# EAGLE design openvfo_nextion_teensy_4.0 (EAGLE 9.5.2)
Assembly variants: <unnamed>
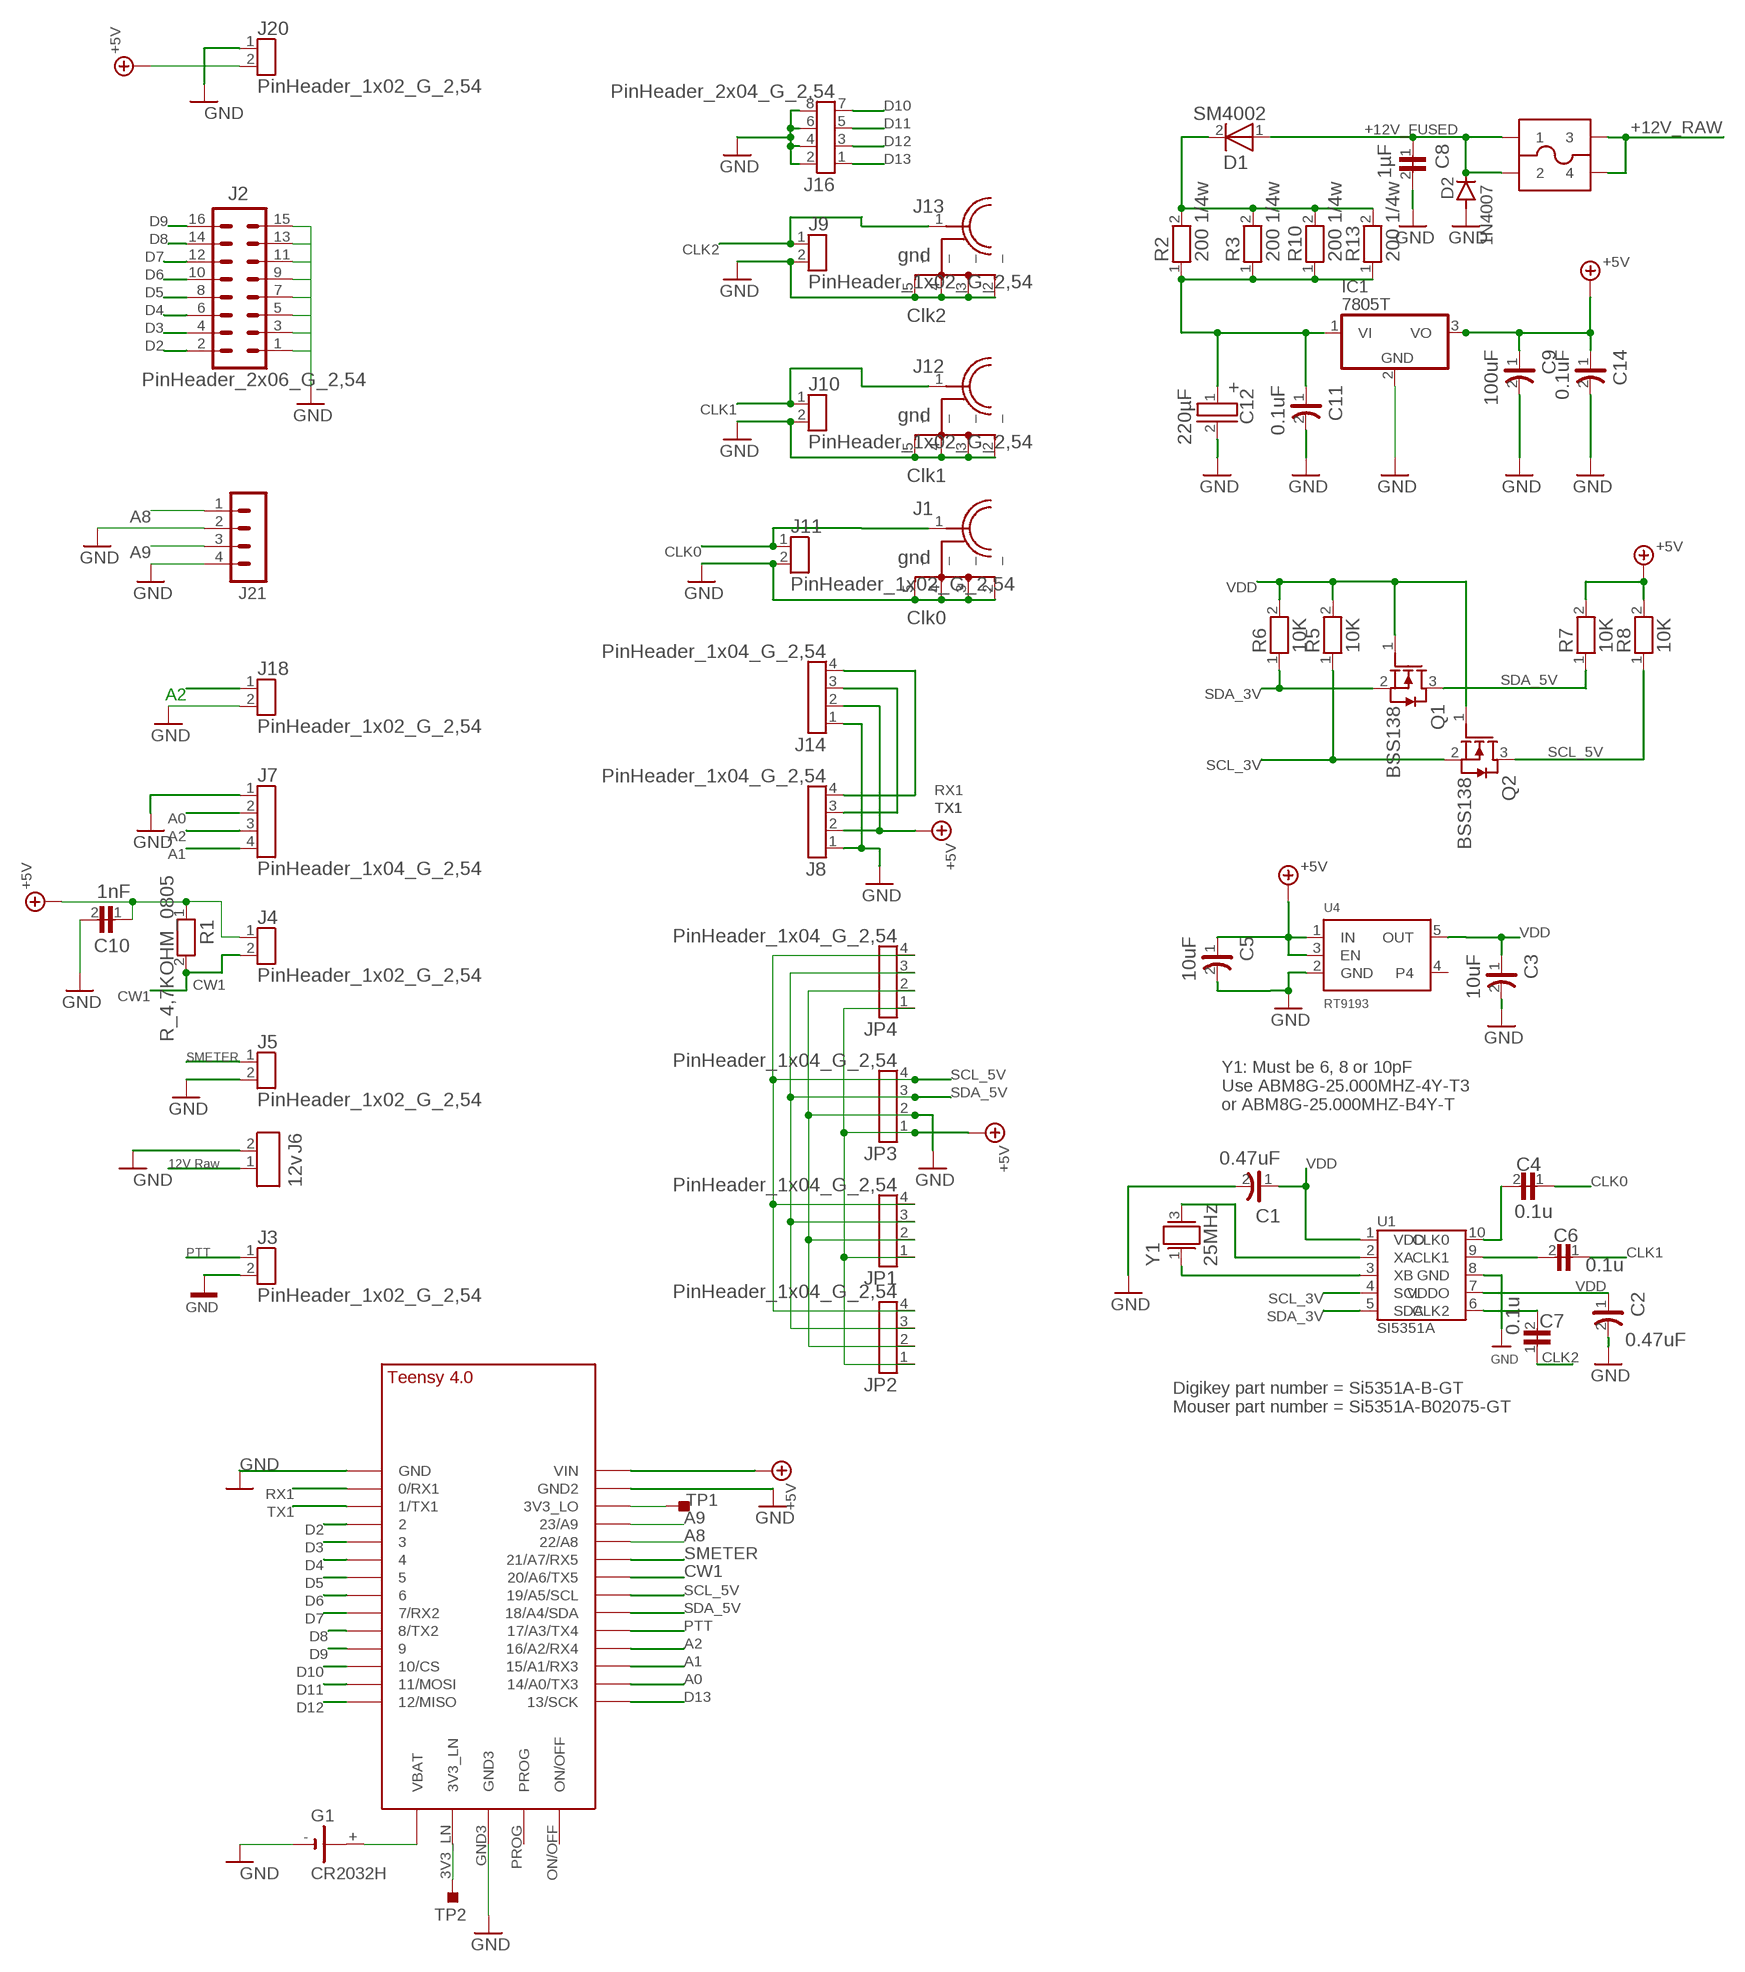
[diagram p0: schematic, sheet 1]

## Parts
C1  0.47uF  C-0805_3  [0805_3]
C2  0.47uF  C-0805_4  [0805_4]
C3  10uF  C-0805_13  [0805_13]
C4  0.1u  C_0805_1000PF_50V__81  [0805_81]
C5  10uF  C-0805_12  [0805_12]
C6  0.1u  C_0805_1000PF_50V__82  [0805_82]
C7  0.1u  C_0805_1000PF_50V__83  [0805_83]
C8  1µF  CMCC_1206_1,0µF_50V_10%_X7R_84  [1206_84]
C9  100uF  C-0805_95  [0805_95]
C10  1nF  C_0805_1000PF_50V__23  [0805_23]
C11  0.1uF  C-0805_89  [0805_89]
C12  220µF  RE2J_25V_220µF_104  [D8R3,81_ELKO_104]
C14  0.1uF  C-0805_96  [0805_96]
D1  SM4002  SM4002_85  [MELF_85]
D2  1N4007  1N4004  [DO41-10]
F1  SMALLFUSE  [SMALLFUSE]
G1  CR2032H  [CR2032H]
IC1  7805T  [TO220H]
J1  Clk0  SMA-EINBAUBUCHSE_67  [SMA-EINBAUBUCHSE_67]
J2  PinHeader_2x06_G_2,54  MA08-2  [MA08-2]
J3  PinHeader_1x02_G_2,54  PINHEADER_1X02_G_2,54_17  [STIFTLEISTE_1X02_G_2,54_17]
J4  PinHeader_1x02_G_2,54  PINHEADER_1X02_G_2,54_18  [STIFTLEISTE_1X02_G_2,54_18]
J5  PinHeader_1x02_G_2,54  PINHEADER_1X02_G_2,54_19  [STIFTLEISTE_1X02_G_2,54_19]
J6  12v  640456-2_20  [SL-MTA/2.54/2POL_20]
J7  PinHeader_1x04_G_2,54  PINHEADER_1X04_G_2,54_15  [STIFTLEISTE_1X04_G_2,54_15]
J8  PinHeader_1x04_G_2,54  PINHEADER_1X04_G_2,54_22  [STIFTLEISTE_1X04_G_2,54_22]
J9  PinHeader_1x02_G_2,54  PINHEADER_1X02_G_2,54_49  [STIFTLEISTE_1X02_G_2,54_49]
J10  PinHeader_1x02_G_2,54  PINHEADER_1X02_G_2,54_50  [STIFTLEISTE_1X02_G_2,54_50]
J11  PinHeader_1x02_G_2,54  PINHEADER_1X02_G_2,54_51  [STIFTLEISTE_1X02_G_2,54_51]
J12  Clk1  SMA-EINBAUBUCHSE_68  [SMA-EINBAUBUCHSE_68]
J13  Clk2  SMA-EINBAUBUCHSE_69  [SMA-EINBAUBUCHSE_69]
J14  PinHeader_1x04_G_2,54  PINHEADER_1X04_G_2,54_70  [STIFTLEISTE_1X04_G_2,54_70]
J16  PinHeader_2x04_G_2,54  PINHEADER_2X04_G_2,54_71  [STIFTLEISTE_2X04_G_2,54_71]
J18  PinHeader_1x02_G_2,54  PINHEADER_1X02_G_2,54_97  [STIFTLEISTE_1X02_G_2,54_97]
J20  PinHeader_1x02_G_2,54  PINHEADER_1X02_G_2,54_137  [STIFTLEISTE_1X02_G_2,54_137]
J21  MA04-1  [MA04-1]
JP1  PinHeader_1x04_G_2,54  PINHEADER_1X04_G_2,54_14  [STIFTLEISTE_1X04_G_2,54_14]
JP2  PinHeader_1x04_G_2,54  PINHEADER_1X04_G_2,54_14  [STIFTLEISTE_1X04_G_2,54_14]
JP3  PinHeader_1x04_G_2,54  PINHEADER_1X04_G_2,54_14  [STIFTLEISTE_1X04_G_2,54_14]
JP4  PinHeader_1x04_G_2,54  PINHEADER_1X04_G_2,54_14  [STIFTLEISTE_1X04_G_2,54_14]
Q1  BSS138  BSS138_7  [SOT23/3_7]
Q2  BSS138  BSS138_8  [SOT23/3_8]
R1  R_4,7KOHM_0805  R_4,7KOHM_0805_21  [0805_21]
R2  200 1/4w  R_SMD_200-OHM_0805_142  [0805_142]
R3  200 1/4w  R_SMD_200-OHM_0805_145  [0805_145]
R5  10K  R_SMD_10K_0805_5  [0805_5]
R6  10K  R_SMD_10K_0805_6  [0805_6]
R7  10K  R_SMD_10K_0805_9  [0805_9]
R8  10K  R_SMD_10K_0805_10  [0805_10]
R10  200 1/4w  R_SMD_200-OHM_0805_146  [0805_146]
R13  200 1/4w  R_SMD_200-OHM_0805_147  [0805_147]
TP1  TESTPOINT_TPS-PAD-036  [TESTPOINT_PAD-036]
TP2  TESTPOINT_TPS-PAD-036  [TESTPOINT_PAD-036]
U1  SI5351A  SI5351A_0  [MSOP10/WB3X3/P0,5_0]
U4  RT9193  VREG_SOT23-5_11  [SOT23-5_11]
U$1  TEENSY_4.0  [TEENSY_4.0]
Y1  25MHz  LFXTAL033075_1  [CFPX-104_1]

## Nets
+5V: C5.1 C9.1 C10.1 C14.1 IC1.3(VO) J4.1 J8.2 J14.2 J20.2 JP1.1 JP2.1 JP3.1 JP4.1 R1.1 R7.2 R8.2 U4.1(IN) U4.3(EN) U$1.VIN
+12V_FUSED: C8.1 D1.1 D2.C F1.P$1 F1.P$2
+12V_RAW: F1.P$3 F1.P$4 J6.1
A0: J7.2 U$1.14/A0(14/A0/TX3)
A1: J7.4 U$1.15/A1(15/A1/RX3)
A2: J7.3 J18.1 U$1.16/A2(16/A2/RX4)
A8: J21.1 U$1.22/A8
A9: J21.3 U$1.23/A9
CLK0: C4.1 J1.1 J11.1
CLK1: C6.1 J10.1 J12.1
CLK2: C7.1 J9.1 J13.1
CW1: J4.2 R1.2 U$1.20/A6(20/A6/TX5)
D2: J2.2 U$1.2
D3: J2.4 U$1.3/CANTX
D4: J2.6 U$1.4/CANRX
D5: J2.8 U$1.5
D6: J2.10 U$1.6
D7: J2.12 U$1.7(7/RX2)
D8: J2.14 U$1.8(8/TX2)
D9: J2.16 U$1.9/CS
D10: J16.7 U$1.10/CS
D11: J16.5 U$1.11/MOSI
D12: J16.3 U$1.12/MISO
D13: J16.1 U$1.13/SCK
GND: C1.2 C2.2 C3.2 C5.2 C8.2 C9.2 C10.2 C11.2 C12.2 C14.2 D2.A G1.- IC1.2(GND) J1.2(_) J1.3(_) J1.4(_) J1.5(_) J2.1 J2.3 J2.5 J2.7 J2.9 J2.11 J2.13 J2.15 J3.2 J5.2 J6.2 J7.1 J8.1 J9.2 J10.2 J11.2 J12.2(_) J12.3(_) J12.4(_) J12.5(_) J13.2(_) J13.3(_) J13.4(_) J13.5(_) J14.1 J16.2 J16.4 J16.6 J16.8 J18.2 J20.1 J21.2 J21.4 JP1.2 JP2.2 JP3.2 JP4.2 U1.8(GND) U4.2(GND) U$1.GND U$1.GND2 U$1.GND3
N$1: TP2.1(TP) U$1.3V3_LN
N$2: TP1.1(TP) U$1.3V3_LO
N$6: G1.+ U$1.VBAT\(VBAT)
PTT: J3.1 U$1.17/A3(17/A3/TX4)
RX1: J8.4 J14.4 U$1.0/RX(0/RX1)
SCL_3V: Q2.2 R5.1 U1.4(SCL)
SCL_5V: JP1.4 JP2.4 JP3.4 JP4.4 Q2.3 R8.1 U$1.19/A5/SCL
SDA_3V: Q1.2 R6.1 U1.5(SDA)
SDA_5V: JP1.3 JP2.3 JP3.3 JP4.3 Q1.3 R7.1 U$1.18/A4/SDA
SIG$152: C4.2 U1.10(CLK0)
SIG$153: C6.2 U1.9(CLK1)
SIG$154: C7.2 U1.6(CLK2)
SIG$156: U1.2(XA) Y1.3
SIG$165: U1.3(XB) Y1.1
SIG$193: C11.1 C12.1 IC1.1(VI) R2.1 R3.1 R10.1 R13.1
SIG$264: D1.2 R2.2 R3.2 R10.2 R13.2
SMETER: J5.1 U$1.21/A7(21/A7/RX5)
TX1: J8.3 J14.3 U$1.1/TX(1/TX1)
VDD: C1.1 C2.1 C3.1 Q1.1 Q2.1 R5.2 R6.2 U1.1(VDD) U1.7(VDDO) U4.5(OUT)
Unconnected: G1.+@1(+) U4.4 U$1.ON/OFF U$1.PROG

## Notes on the sheet
- A2
- SMETER
- Y1: Must be 6, 8 or 10pF
- Use ABM8G-25.000MHZ-4Y-T3
- or ABM8G-25.000MHZ-B4Y-T
- 12V Raw
- PTT
- Digikey part number = Si5351A-B-GT
- Mouser part number = Si5351A-B02075-GT

## Library data of the parts
C1 = TARGET3001!_V20.6.0.4:C-0805_3: Capacitor (Ansi,IEC,new DIN)
C2 = TARGET3001!_V20.6.0.4:C-0805_4: Capacitor (Ansi,IEC,new DIN)
C3 = TARGET3001!_V20.6.0.4:C-0805_13: Capacitor (Ansi,IEC,new DIN)
C4 = TARGET3001!_V20.6.0.4:C_0805_1000PF_50V__81
C5 = TARGET3001!_V20.6.0.4:C-0805_12: Capacitor (Ansi,IEC,new DIN)
C6 = TARGET3001!_V20.6.0.4:C_0805_1000PF_50V__82
C7 = TARGET3001!_V20.6.0.4:C_0805_1000PF_50V__83
C8 = TARGET3001!_V20.6.0.4:CMCC_1206_1,0µF_50V_10%_X7R_84: Chip Monolithic Ceramic Capacitors (CMCC) 1206 1,0µF 50V X7R Capacitance Tolerance 10% Manufacturer Part Number GRM31MR71H105K
C9 = TARGET3001!_V20.6.0.4:C-0805_95: Capacitor (Ansi,IEC,new DIN)
C10 = TARGET3001!_V20.6.0.4:C_0805_1000PF_50V__23
C11 = TARGET3001!_V20.6.0.4:C-0805_89: Capacitor (Ansi,IEC,new DIN)
C12 = TARGET3001!_V20.6.0.4:RE2J_25V_220µF_104
C14 = TARGET3001!_V20.6.0.4:C-0805_96: Capacitor (Ansi,IEC,new DIN)
D1 = TARGET3001!_V20.6.0.4:SM4002_85
D2 = diode:1N4004: DIODE general purpose rectifier, 1 A
F1 = 000_ICS:SMALLFUSE; 1PC: 0.98; DIGIKEY: 36-3568-ND; HEIGHT: 12; MFG: Keystone; MPN: 3568
G1 = battery:CR2032H: LI BATTERY Varta
IC1 = linear:78*: Positive VOLTAGE REGULATOR Source: http://cache.national.com/ds/LM/LM78L05.pdf http://www.fairchildsemi.com/ds/LM/LM7805.pdf
J1 = TARGET3001!_V20.6.0.4:SMA-EINBAUBUCHSE_67: SMA-Einbaubuchse; Printmontage 180°, Lötanschluss, vergoldet
J2 = con-lstb:MA08-2: PIN HEADER; OC_FARNELL: unknown; OC_NEWARK: unknown
J3 = TARGET3001!_V20.6.0.4:PINHEADER_1X02_G_2,54_17: Pin Header
J4 = TARGET3001!_V20.6.0.4:PINHEADER_1X02_G_2,54_18: Pin Header
J5 = TARGET3001!_V20.6.0.4:PINHEADER_1X02_G_2,54_19: Pin Header
J6 = TARGET3001!_V20.6.0.4:640456-2_20
J7 = TARGET3001!_V20.6.0.4:PINHEADER_1X04_G_2,54_15: Pin Header
J8 = TARGET3001!_V20.6.0.4:PINHEADER_1X04_G_2,54_22: Pin Header
J9 = TARGET3001!_V20.6.0.4:PINHEADER_1X02_G_2,54_49: Pin Header
J10 = TARGET3001!_V20.6.0.4:PINHEADER_1X02_G_2,54_50: Pin Header
J11 = TARGET3001!_V20.6.0.4:PINHEADER_1X02_G_2,54_51: Pin Header
J12 = TARGET3001!_V20.6.0.4:SMA-EINBAUBUCHSE_68: SMA-Einbaubuchse; Printmontage 180°, Lötanschluss, vergoldet
J13 = TARGET3001!_V20.6.0.4:SMA-EINBAUBUCHSE_69: SMA-Einbaubuchse; Printmontage 180°, Lötanschluss, vergoldet
J14 = TARGET3001!_V20.6.0.4:PINHEADER_1X04_G_2,54_70: Pin Header
J16 = TARGET3001!_V20.6.0.4:PINHEADER_2X04_G_2,54_71: Pin Header
J18 = TARGET3001!_V20.6.0.4:PINHEADER_1X02_G_2,54_97: Pin Header
J20 = TARGET3001!_V20.6.0.4:PINHEADER_1X02_G_2,54_137: Pin Header
J21 = con-lstb:MA04-1: PIN HEADER; OC_FARNELL: unknown; OC_NEWARK: unknown
JP1-JP4 = TARGET3001!_V20.6.0.4:PINHEADER_1X04_G_2,54_14: Pin Header
Q1 = TARGET3001!_V20.6.0.4:BSS138_7: Small signal transistor UCE:50V, ICE:22mA
Q2 = TARGET3001!_V20.6.0.4:BSS138_8: Small signal transistor UCE:50V, ICE:22mA
R1 = TARGET3001!_V20.6.0.4:R_4,7KOHM_0805_21: Metal Glaze SMD Chip Resistors 0805, 1%, 4,7K Ohm
R2 = TARGET3001!_V20.6.0.4:R_SMD_200-OHM_0805_142: SMD-resistor 200-Ohm, 0,125W, 1%
R3 = TARGET3001!_V20.6.0.4:R_SMD_200-OHM_0805_145: SMD-resistor 200-Ohm, 0,125W, 1%
R5 = TARGET3001!_V20.6.0.4:R_SMD_10K_0805_5: SMD-resistor 10K-Ohm, 0,125W, 1%
R6 = TARGET3001!_V20.6.0.4:R_SMD_10K_0805_6: SMD-resistor 10K-Ohm, 0,125W, 1%
R7 = TARGET3001!_V20.6.0.4:R_SMD_10K_0805_9: SMD-resistor 10K-Ohm, 0,125W, 1%
R8 = TARGET3001!_V20.6.0.4:R_SMD_10K_0805_10: SMD-resistor 10K-Ohm, 0,125W, 1%
R10 = TARGET3001!_V20.6.0.4:R_SMD_200-OHM_0805_146: SMD-resistor 200-Ohm, 0,125W, 1%
R13 = TARGET3001!_V20.6.0.4:R_SMD_200-OHM_0805_147: SMD-resistor 200-Ohm, 0,125W, 1%
TP1 TP2 = 52101-101-REV-A:TESTPOINT_TPS: TEST POINT PAD; BOM: EXCLUDE
U1 = TARGET3001!_V20.6.0.4:SI5351A_0
U4 = TARGET3001!_V20.5.0.73:VREG_SOT23-5_11
U$1 = TEENSY 4.0:TEENSY_4.0
Y1 = TARGET3001!_V20.6.0.4:LFXTAL033075_1: Quartz 25 MHz, LF XTAL033075, IQD, Series CFPX-104, Frequency 25MHz,

## Board
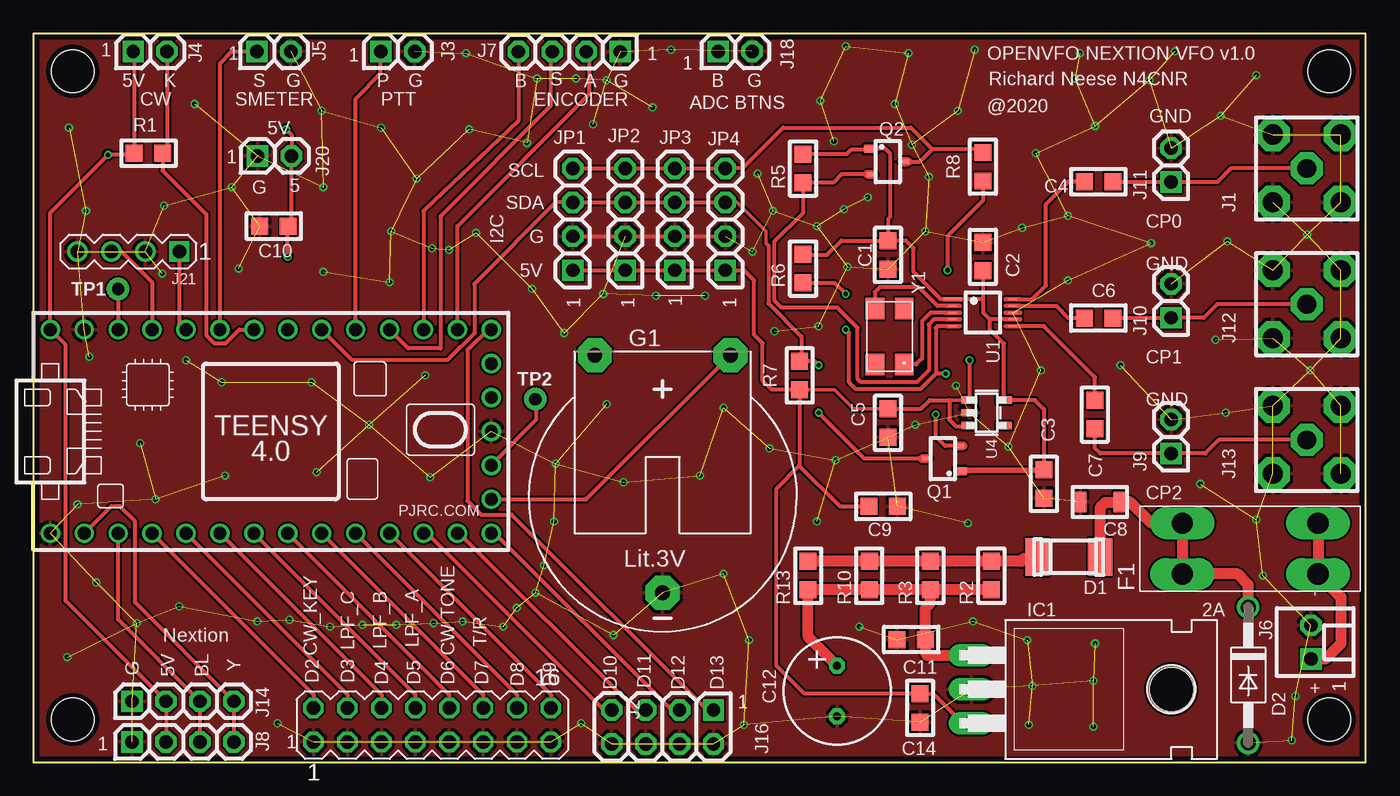
[diagram p1: board, top side]
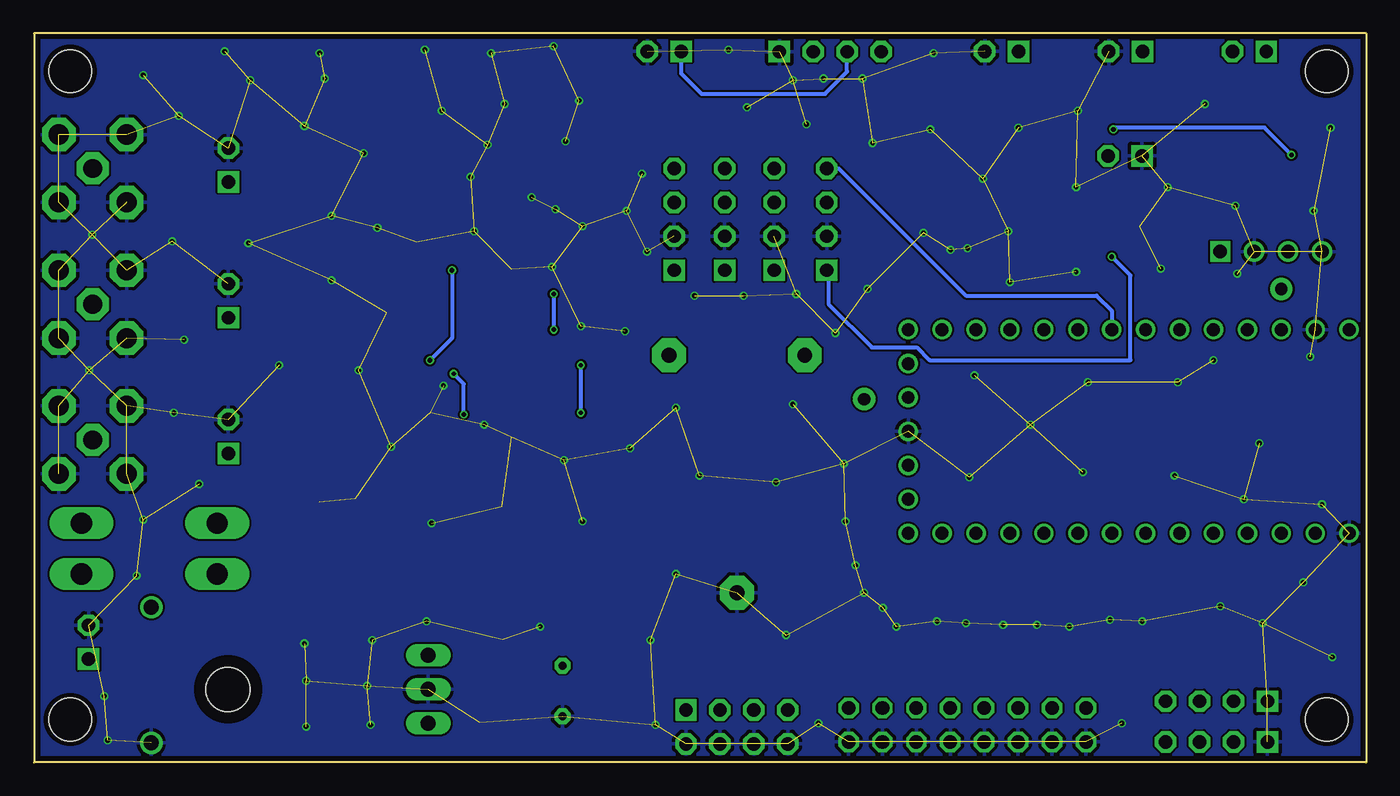
[diagram p2: board, bottom side, seen from below]

Size 99.75 x 54.56 mm. Coordinates in mm from the lower left corner, seen from the top.
Outline: 0,0 99.75,0 99.75,54.56 0,54.56 0,0
Copper layers (1*16): Top 0.035559375mm / dielectric 1.6mm / Bottom 0.035559375mm
Design rules "oshpark-2layer": minimum track width 6mil, minimum drill 10mil, track to track 6mil, track to pad 6mil, pad to pad 6mil, via to via 6mil, smd to smd 6mil, copper to edge 15mil, drill to drill 6mil, minimum pad ring 5mil, minimum via ring 5mil, stop-mask expansion 2.5mil, vias tented up to drill 0mil, thermal gap 10mil
Holes 3.2 mm at 2.95,51.74 2.95,3.2 97.05,51.74 97.05,3.2

### Footprints (pad centres in the part's own frame; a part is rotated, then mirrored left to right if it is on the bottom)
0805_3 = smd 1.27 x 1.27: 1 -1.067,0; 2 1.067,0
0805_4 = smd 1.27 x 1.27: 1 -1.067,0; 2 1.067,0
0805_13 = smd 1.27 x 1.27: 1 -1.067,0; 2 1.067,0
0805_81 = smd 1.27 x 1.27: 1 -1.067,0; 2 1.067,0
0805_12 = smd 1.27 x 1.27: 1 -1.067,0; 2 1.067,0
0805_82 = smd 1.27 x 1.27: 1 -1.067,0; 2 1.067,0
0805_83 = smd 1.27 x 1.27: 1 -1.067,0; 2 1.067,0
1206_84 = smd 0.9 x 1.6: 1 -1.45,0; 2 1.45,0
0805_95 = smd 1.27 x 1.27: 1 -1.067,0; 2 1.067,0
0805_23 = smd 1.27 x 1.27: 1 -1.067,0; 2 1.067,0
0805_89 = smd 1.27 x 1.27: 1 -1.067,0; 2 1.067,0
D8R3,81_ELKO_104 = drill 0.6 pad 1.2 octagon: 1 -1.905,0; 2 1.905,0
0805_96 = smd 1.27 x 1.27: 1 -1.067,0; 2 1.067,0
MELF_85 = smd 1.8 x 2.8: 1 -2.35,0; 2 2.35,0
DO41-10 = drill 1.118: A 5.08,0; C -5.08,0
SMALLFUSE = drill 1.6 pad 1.676 long: P$1 -5.08,1.905; P$2 -5.08,-1.905; P$3 5.08,1.905; P$4 5.08,-1.905
CR2032H = drill 1.118 pad 2.54 octagon: + 5.08,10.795; +@1 -5.08,10.795; - 0,-6.985
TO220H = drill 1.118 long: 1 -2.54,-10.16; 2 0,-10.16; 3 2.54,-10.16 | hole 3.302: 0,4.826
SMA-EINBAUBUCHSE_67 = drill 1.4 pad 2.4 octagon: 1 0,0 | drill 1.5 pad 2.5 octagon: 2 2.54,-2.54; 3 2.54,2.54; 4 -2.54,2.54; 5 -2.54,-2.54
MA08-2 = drill 1.016 octagon: 1 -8.89,-1.27; 2 -8.89,1.27; 3 -6.35,-1.27; 4 -6.35,1.27; 5 -3.81,-1.27; 6 -3.81,1.27; 7 -1.27,-1.27; 8 -1.27,1.27; 9 1.27,-1.27; 10 1.27,1.27; 11 3.81,-1.27; 12 3.81,1.27; 13 6.35,-1.27; 14 6.35,1.27; 15 8.89,-1.27; 16 8.89,1.27
STIFTLEISTE_1X02_G_2,54_17 = drill 1 pad 1.6 square: 1 0,0 | drill 1 pad 1.6 octagon: 2 2.54,0
STIFTLEISTE_1X02_G_2,54_18 = drill 1 pad 1.6 square: 1 0,0 | drill 1 pad 1.6 octagon: 2 2.54,0
STIFTLEISTE_1X02_G_2,54_19 = drill 1 pad 1.6 square: 1 0,0 | drill 1 pad 1.6 octagon: 2 2.54,0
SL-MTA/2.54/2POL_20 = drill 1 pad 1.6 square: 1 1.27,0 | drill 1 pad 1.6 octagon: 2 -1.27,0
STIFTLEISTE_1X04_G_2,54_15 = drill 1 pad 1.6 square: 1 0,0 | drill 1 pad 1.6 octagon: 2 2.54,0; 3 5.08,0; 4 7.62,0
STIFTLEISTE_1X04_G_2,54_22 = drill 1 pad 1.6 square: 1 0,0 | drill 1 pad 1.6 octagon: 2 2.54,0; 3 5.08,0; 4 7.62,0
STIFTLEISTE_1X02_G_2,54_49 = drill 1 pad 1.6 square: 1 0,0 | drill 1 pad 1.6 octagon: 2 2.54,0
STIFTLEISTE_1X02_G_2,54_50 = drill 1 pad 1.6 square: 1 0,0 | drill 1 pad 1.6 octagon: 2 2.54,0
STIFTLEISTE_1X02_G_2,54_51 = drill 1 pad 1.6 square: 1 0,0 | drill 1 pad 1.6 octagon: 2 2.54,0
SMA-EINBAUBUCHSE_68 = drill 1.4 pad 2.4 octagon: 1 0,0 | drill 1.5 pad 2.5 octagon: 2 2.54,-2.54; 3 2.54,2.54; 4 -2.54,2.54; 5 -2.54,-2.54
SMA-EINBAUBUCHSE_69 = drill 1.4 pad 2.4 octagon: 1 0,0 | drill 1.5 pad 2.5 octagon: 2 2.54,-2.54; 3 2.54,2.54; 4 -2.54,2.54; 5 -2.54,-2.54
STIFTLEISTE_1X04_G_2,54_70 = drill 1 pad 1.6 square: 1 0,0 | drill 1 pad 1.6 octagon: 2 2.54,0; 3 5.08,0; 4 7.62,0
STIFTLEISTE_2X04_G_2,54_71 = drill 1 pad 1.6 square: 1 0,0 | drill 1 pad 1.6 octagon: 2 0,2.54; 3 2.54,0; 4 2.54,2.54; 5 5.08,0; 6 5.08,2.54; 7 7.62,0; 8 7.62,2.54
STIFTLEISTE_1X02_G_2,54_97 = drill 1 pad 1.6 square: 1 0,0 | drill 1 pad 1.6 octagon: 2 2.54,0
STIFTLEISTE_1X02_G_2,54_137 = drill 1 pad 1.6 square: 1 0,0 | drill 1 pad 1.6 octagon: 2 2.54,0
MA04-1 = drill 1.016 square: 1 -3.81,0 | drill 1.016: 2 -1.27,0; 3 1.27,0; 4 3.81,0
STIFTLEISTE_1X04_G_2,54_14 = drill 1 pad 1.6 square: 1 0,0 | drill 1 pad 1.6 octagon: 2 2.54,0; 3 5.08,0; 4 7.62,0
SOT23/3_7 = smd 0.65 x 1.06: 1 -0.95,-1.3 | smd 0.325 x 0.53: 2 0.95,-1.3; 3 0,1.3
SOT23/3_8 = smd 0.65 x 1.06: 1 -0.95,-1.3 | smd 0.325 x 0.53: 2 0.95,-1.3; 3 0,1.3
0805_21 = smd 1.27 x 1.27: 1 -1.067,0; 2 1.067,0
0805_142 = smd 1.27 x 1.27: 1 -1.067,0; 2 1.067,0
0805_145 = smd 1.27 x 1.27: 1 -1.067,0; 2 1.067,0
0805_5 = smd 1.27 x 1.27: 1 -1.067,0; 2 1.067,0
0805_6 = smd 1.27 x 1.27: 1 -1.067,0; 2 1.067,0
0805_9 = smd 1.27 x 1.27: 1 -1.067,0; 2 1.067,0
0805_10 = smd 1.27 x 1.27: 1 -1.067,0; 2 1.067,0
0805_146 = smd 1.27 x 1.27: 1 -1.067,0; 2 1.067,0
0805_147 = smd 1.27 x 1.27: 1 -1.067,0; 2 1.067,0
TESTPOINT_PAD-036 = drill 0.914 pad 1.676: 1 0,0
MSOP10/WB3X3/P0,5_0 = smd 0.3 x 1.4: 1 -1,-2.25 | smd 0.15 x 0.7: 2 -0.5,-2.25; 3 0,-2.25; 4 0.5,-2.25; 5 1,-2.25; 6 1,2.25; 7 0.5,2.25; 8 0,2.25; 9 -0.5,2.25; 10 -1,2.25
SOT23-5_11 = smd 0.55 x 1.2: 1 -0.95,-1.3; 2 0,-1.3; 3 0.95,-1.3; 4 0.95,1.3; 5 -0.95,1.3
TEENSY_4.0 = drill 0.965: 0/RX -13.97,-7.62; 1/TX -11.43,-7.62; 2 -8.89,-7.62; 3/CANTX -6.35,-7.62; 3V3_LN 16.51,-2.54; 3V3_LO -11.43,7.62; 4/CANRX -3.81,-7.62; 5 -1.27,-7.62; 6 1.27,-7.62; 7 3.81,-7.62; 8 6.35,-7.62; 9/CS 8.89,-7.62; 10/CS 11.43,-7.62; 11/MOSI 13.97,-7.62; 12/MISO 16.51,-7.62; 13/SCK 16.51,7.62; 14/A0 13.97,7.62; 15/A1 11.43,7.62; 16/A2 8.89,7.62; 17/A3 6.35,7.62; 18/A4/SDA 3.81,7.62; 19/A5/SCL 1.27,7.62; 20/A6 -1.27,7.62; 21/A7 -3.81,7.62; 22/A8 -6.35,7.62; 23/A9 -8.89,7.62; GND -16.51,-7.62; GND2 -13.97,7.62; GND3 16.51,0; ON/OFF 16.51,5.08; PROG 16.51,2.54; VBAT\ 16.51,-5.08; VIN -16.51,7.62
CFPX-104_1 = smd 1.6 x 1.4: 1 -2.1,-1.1; 2 2.1,-1.1; 3 2.1,1.1; 4 -2.1,1.1

### Placement (x,y rotation side)
C1  63.99,37.97 270 top
C2  71.1,37.85 90 top
C3  75.67,20.83 270 top
C4  79.76,43.46 180 top
C5  63.99,25.4 270 top
C6  79.76,33.25 180 top
C7  79.48,26.04 90 top
C8  79.86,19.48 180 top
C9  63.63,19.15 0 top
C10  18.01,40.13 180 top
C11  65.74,9.19 180 top
C12  60.18,5.33 270 top
C14  66.4,4.06 270 top
D1  77.53,15.37 180 top
D2  90.96,6.53 270 top
F1  91.12,15.99 0 top
G1  47.12,19.68 0 top
IC1  80.39,5.46 270 top
J1  95.35,44.45 270 top
J2  29.87,2.79 0 top
J3  26.01,53.21 0 top
J4  7.47,53.21 0 top
J5  16.74,53.21 0 top
J6  95.66,8.99 270 top
J7  43.94,53.19 180 top
J8  7.39,1.52 0 top
J9  85.19,23.11 90 top
J10  85.19,33.27 90 top
J11  85.19,43.43 90 top
J12  95.35,34.29 270 top
J13  95.35,24.13 270 top
J14  7.39,4.57 0 top
J16  50.93,3.91 180 top
J18  51.29,53.21 0 top
J20  16.79,45.39 0 top
J21  7.11,38.23 180 top
JP1  40.39,36.83 90 top
JP2  44.32,36.83 90 top
JP3  48.03,36.83 90 top
JP4  51.82,36.83 90 top
Q1  68.09,22.73 90 top
Q2  63.99,44.96 270 top
R1  8.61,45.59 0 top
R2  71.73,13.97 90 top
R3  67.16,13.97 90 top
R5  57.64,44.45 90 top
R6  57.64,36.96 90 top
R7  57.38,28.96 270 top
R8  71.1,44.58 270 top
R10  62.59,13.97 90 top
R13  58.02,13.97 90 top
TP1  6.35,35.43 0 top
TP2  37.59,27.18 0 top
U1  71.1,33.66 270 top
U4  71.37,26.16 270 top
U$1  17.78,24.77 0 top
Y1  64.11,31.88 90 top

### Tracks (layer width: path | path; a pad name or v marks a point on that pad's centre or on a via)
+5V  (via drill 0.35)
  Top 0.152: 7.55,53.14 J4.1 | C10.1 19.33,40.38 | 70.01,25.15 U4.3 | 57.38,22.23 57.38,22.17
  Top 0.254: U4.1 69.98,27.11 68.58,27.11 | R7.2 60,27.89 61.42,26.47 C5.1
  Top 0.305: JP1.1 JP2.1 JP3.1 JP4.1 53.21,36.83 53.98,36.07 53.98,32 54.61,31.37 54.61,28.57 55.3,27.89 R7.2 57.38,22.23 55.63,20.47 55.63,7.24 57.73,5.13 C14.1 67.39,5.13 69.6,2.92 IC1.3 | 7.55,53.14 R1.1 7.42,45.47 v5.59,45.47 1.27,41.15 U$1.VIN 2.41,31.24 2.41,12.09 J14.2 J8.2 | 70.01,25.15 69.09,25.15 68.58,25.65 68.58,27.11 67.12,27.11 66.47,26.47 C5.1 | C9.1 60.4,19.15 57.38,22.17 | 19.33,40.38 J20.2 19.33,46.97 v18.92,47.37 | v19.05,37.85 19.05,40.1 C10.1 | R8.2 71.1,42.01 68.45,39.37 v68.45,36.83 | v70.1,30.1 70.1,27.24 69.98,27.11
  Bottom 0.305: JP1.1 40.26,36.7 40.26,34.29 37.02,31.05 33.64,31.05 32.69,30.1 17.65,30.1 17.65,36.45 v19.05,37.85 | v5.59,45.47 7.62,47.5 18.8,47.5 v18.92,47.37 | v68.45,36.83 68.45,31.75 v70.1,30.1
+12V_FUSED
  Top 0.305: C8.1 81.26,19.43
  Top 0.813: C8.1 82.12,19.48 83.7,17.89 F1.P$1 F1.P$2 86.05,14.1 90.17,14.1 90.96,13.3 D2.C | 81.26,19.43 80.26,19.43 79.88,19.04 D1.1
+12V_RAW
  Top 0.813: J6.1 96.75,7.72 97.92,8.89 97.92,12.36 F1.P$4 F1.P$3
A0
  Top 0.305: U$1.14/A0 31.75,40.13 41.66,50.04 41.66,52.94 J7.2
A1
  Top 0.305: J7.4 36.32,48.01 29.21,41.27 U$1.15/A1
A2
  Top 0.152: J7.3 38.73,53.06
  Top 0.305: 38.73,53.06 38.73,49.13 30.48,40.87 30.48,30.99 28.07,30.99 U$1.16/A2
  Bottom 0.305: J18.1 51.29,51.56 49.76,50.04 40.51,50.04 38.86,51.69 J7.3
A8
  Top 0.305: J21.1 10.92,32.89 U$1.22/A8
A9
  Top 0.305: J21.3 6.6,38.23 8.89,35.94 U$1.23/A9
CLK0
  Top 0.305: J1.1 89.66,44.45 88.65,43.43 J11.1 80.85,43.43 C4.1
CLK1
  Top 0.305: J12.1 88.65,34.29 87.63,33.27 J10.1 85.22,33.25 C6.1
CLK2
  Top 0.305: J13.1 88.77,24.13 87.76,23.11 J9.1 79.88,23.11 79.48,23.52 C7.1
CW1
  Top 0.152: 10.01,45.67 9.93,45.59 R1.2
  Top 0.305: J4.2 10.01,45.67 | R1.2 9.68,44.3 12.94,41.03 12.94,31.96 13.54,31.36 14.4,31.36 15.43,32.38 U$1.20/A6
D2
  Top 0.305: U$1.2 20.98,5.06 J2.2
D3
  Top 0.305: U$1.3/CANTX 23.52,5.06 J2.4
D4
  Top 0.305: U$1.4/CANRX 26.06,5.06 J2.6
D5
  Top 0.305: U$1.5 28.6,5.06 J2.8
D6
  Top 0.305: U$1.6 31.14,5.06 J2.10
D7
  Top 0.305: U$1.7 33.68,5.06 J2.12
D8
  Top 0.305: U$1.8 36.22,5.06 J2.14
D9
  Top 0.305: U$1.9/CS 38.76,5.06 J2.16
D10
  Top 0.305: U$1.10/CS 29.46,17.14 42.7,3.91 J16.7
D11
  Top 0.305: J16.5 45.11,3.91 31.88,17.14 U$1.11/MOSI
D12
  Top 0.305: J16.3 47.78,3.91 34.54,17.14 U$1.12/MISO
D13
  Top 0.305: U$1.13/SCK 34.04,32.38 32.51,30.86 32.51,19.56 33.53,18.54 35.81,18.54 50.44,3.91 J16.1
GND  (via drill 0.35)  (183 unrouted)
  Top 0.305: JP1.2 JP2.2 JP3.2 JP4.2
  other vias: 58.8,32.64 60.71,41.4 29.84,38.48 31.11,38.35 3.94,41.27 9.65,36.58 26.04,47.5 39.75,32.13 69.98,17.91 32.13,10.54 2.67,47.5 12.07,49.28 4.7,13.46 43.43,9.53 7.75,10.41 35.18,10.16 36.2,11.56 37.59,12.7 38.23,14.73 29.97,10.41 27.18,10.29 24.64,10.29 22.22,10.16 19.18,10.67 16.76,10.54 10.92,11.68 14.1,28.45 20.83,28.45 21.21,21.72 14.35,21.46 9.14,19.68 8,23.88 25.15,25.27 29.34,28.96 29.72,21.34 4.19,30.35 11.43,30.1 3.3,19.3 21.72,43.05 26.8,39.75 32.39,53.09 47.75,53.34 46.36,49.02 41.91,47.75 60.83,53.59 58.93,49.53 65.53,53.09 64.52,49.28 70.48,53.34 69.21,48.77 67.06,43.81 66.8,39.75 58.67,40.13 62.48,42.29 54.23,44.07 55.37,41.27 59.94,46.48 65.79,46.23 77.98,51.18 75.06,45.59 91.57,51.44 83.69,38.86 89.41,38.99 95.38,39.5 81.41,29.72 88.52,31.62 95.63,29.34 87.38,20.83 91.57,18.16 92.07,13.97 94.49,4.95 94.23,1.65 74.42,9.14 79.5,8.89 74.8,5.71 79.38,6.1 79.38,2.67 74.55,2.79 51.69,26.54 42.93,26.8 39.12,22.35 38.99,18.03 55.12,23.5 49.91,21.46 44.2,20.95 51.69,14.1 60.07,22.61 58.67,18.03 70.36,10.54 61.85,10.16 75.44,29.34 74.04,40.01 2.54,7.87 18.29,2.92 41.02,2.92 53.21,2.79 9.78,41.66 15.37,36.96 37.34,35.43 42.67,35.05 46.61,34.92 50.29,34.92 53.85,38.23 55.5,32.26 73.02,23.62 66.04,25.27 69.09,28.19 60.96,37.08 53.59,9.14 33.15,39.62 36.96,46.35 37.72,51.18 40.64,51.18 42.93,51.05 32.64,47.37 28.7,43.69 26.67,35.94 21.72,36.7 21.59,48.77 14.86,43.05 89.28,26.16 85.47,53.21 78.36,53.09 83.57,51.05 79.5,47.62 88.9,48.39 77.47,40.89 77.47,36.07
  pour Bottom: 0,0 99.75,0 99.75,54.57 0,54.57
  pour Top: 0,0 99.75,0 99.75,54.57 0,54.57
N$1
  Top 0.305: TP2.1 37.66,27.11 37.66,25.64 34.37,22.35 34.37,22.3 U$1.3V3_LN
N$2
  Top 0.305: TP1.1 U$1.3V3_LO
N$6
  Top 0.305: U$1.VBAT\ 41.4,19.68 G1.+
PTT
  Top 0.305: U$1.17/A3 24.13,49.68 26.01,51.56 J3.1
RX1
  Top 0.305: J8.4 J14.4 7.62,11.96 7.62,18.03 6.48,19.18 6.1,19.18 5.84,19.18 U$1.0/RX
SCL_3V
  Top 0.305: U1.4 67.44,33.16 67.06,32.77 67.06,29.34 66.17,28.45 61.98,28.45 61.72,28.7 61.72,32.51 60.2,34.04 56.01,34.04 55.5,34.54 55.5,38.99 57.66,41.15 57.66,43.36 R5.1 59.89,43.38 60.52,44.01 Q2.2
SCL_5V
  Top 0.152: 70.97,45.64 R8.1
  Top 0.305: JP1.4 JP2.4 JP3.4 JP4.4 53.09,44.45 56.13,47.5 65.71,47.5 67.31,45.9 | 70.97,45.64 70.72,45.9 67.31,45.9 | Q2.3 66.37,44.96 67.31,45.9
  Bottom 0.305: JP1.4 39.5,44.45 29.97,34.92 20.19,34.92 19.05,33.78 U$1.19/A5/SCL
SDA_3V  (via drill 0.33)
  Top 0.305: U1.5 67.71,32.66 67.56,32.51 67.56,29.08 | 67.56,29.08 66.42,27.94 61.59,27.94 61.09,28.45 61.09,32.13 v60.83,32.38 | R6.1 60,35.89 v60.83,35.05 | Q1.2 68.27,23.68 67.56,24.38 v67.56,26.04 | v68.33,29.08 67.56,29.08
  Bottom 0.305: v60.83,35.05 v60.83,32.38 | v67.56,26.04 67.56,28.32 v68.33,29.08
SDA_5V  (via drill 0.33)
  Top 0.254: 54.86,38.86 54.86,39.75 52.71,41.91 JP4.3
  Top 0.305: Q1.3 62.23,22.73 v58.8,26.16 | v58.8,29.72 58.5,30.02 57.53,30.02 | 57.53,30.02 R7.1 | JP4.3 JP3.3 JP2.3 JP1.3 39.12,41.91 33.02,35.81 33.02,32.13 30.99,30.1 23.88,30.1 U$1.18/A4/SDA | 54.86,38.86 55.04,38.68 55.04,34.35 57.53,31.86 57.53,30.02
  Bottom 0.305: v58.8,26.16 v58.8,29.72
SIG$152
  Top 0.305: U1.10 74.79,34.66 75.82,35.69 75.82,41.78 77.49,43.46 C4.2
SIG$153
  Top 0.305: U1.9 76.59,34.16 77.49,33.25 C6.2
SIG$154
  Top 0.305: C7.2 79.5,27.12 79.5,28.83 75.68,32.66 U1.6
SIG$156
  Top 0.305: U1.2 67.7,34.16 66.29,35.56 63.37,35.56 63.01,35.2 Y1.3
SIG$165
  Top 0.305: U1.3 67.18,33.66 66.55,33.02 66.55,30.23 66.1,29.78 Y1.1
SIG$193
  Top 0.813: R2.1 R3.1 | R3.1 R10.1 R13.1 58.02,9.4 C12.1 | R3.1 67.16,11.91 66.81,11.56 C11.1 66.81,8.12 66.93,8 IC1.1
SIG$264
  Top 0.813: D1.2 75.05,15.24 74.17,15.24 73.96,15.04 R2.2 R3.2 R10.2 R13.2
SMETER
  Top 0.305: U$1.21/A7 13.97,52.32 14.86,53.21 J5.1
TX1
  Top 0.305: J8.3 J14.3 6.35,10.69 U$1.1/TX
VDD
  Top 0.305: U1.7 71.62,33.16 | 71.62,33.16 71.12,33.66 71.12,34.67 | 71.12,34.67 68.86,34.67 | 68.86,34.67 U1.1 | 71.12,34.67 71.12,36.63 C2.1 | 68.86,34.67 67.94,34.67 65.91,36.7 65.91,38.48 65.35,39.04 C1.1 | 75.62,21.84 C3.1 75.67,26.44 75,27.11 U4.5 72.67,31.34 71.62,32.39 71.62,33.16 | R5.2 60.88,45.52 61.21,45.85 62.62,45.85 Q2.1 63.82,45.91 64.13,45.59 64.13,40.77 64.01,40.64 64.01,39.06 C1.1 | C1.1 60.5,39.04 59.44,37.97 57.69,37.97 R6.2
  Top 0.406: 75.62,21.84 69.66,21.84 Q1.1

### Text on the board
tPlace: 1 | 1 | 1 | OPENVFO NEXTION VFO v1.0 | 5V | K | S | G | 1 | P | G | B | S | A | G | 1 | B | G | Richard Neese N4CNR | CW | SMETER | PTT | ENCODER | ADC BTNS | @2020 | GND | 5V | 1 | SCL | G | 5 | SDA | I2C | G | CP0 | 5V | GND | 1 | 1 | 1 | 1 | CP1 | GND | CP2 | CW TONE | CW_KEY | LPF_C | LPF_B | LPF_A | - | T/R | 2A | Nextion | G | 5V | BL | Y | D2 | D3 | D4 | D5 | D6 | D7 | D8 | D9 | D11 | D10 | D12 | D13 | 1 | + | 1 | 1 | 1